# Altium schematic sheet Page_Tete.SchDoc
size A4; SheetNumber: 1; SheetTotal: 4
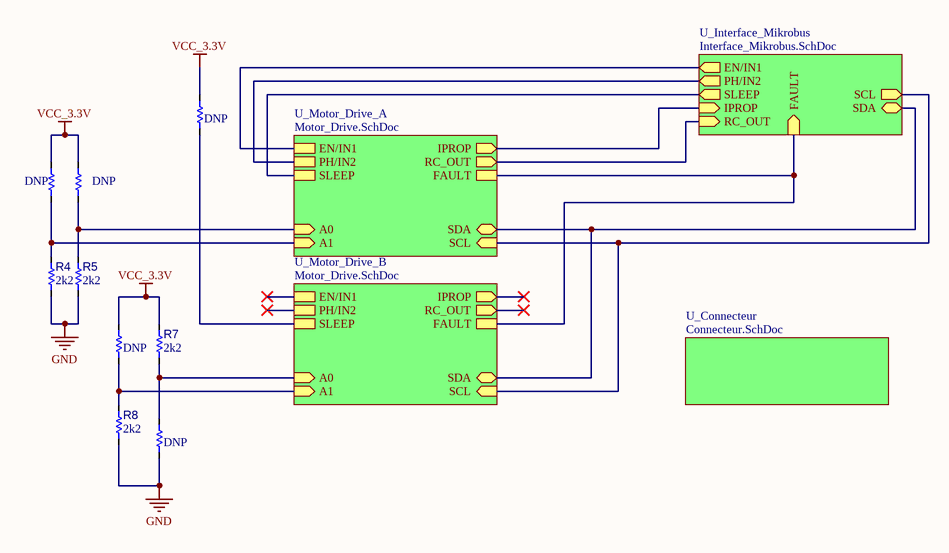
[diagram p0: Page_Tete.SchDoc]

## Parts
R1  value DNP  [R_1005[0402]]  (hidden comment: Res 2k2 1% 0402)  (no BOM)
R2  value DNP  [R_1005[0402]]  (hidden comment: Res 2k2 1% 0402)  (no BOM)
R3  value DNP  [R_1005[0402]]  (hidden comment: Res 2k2 1% 0402)  (no BOM)
R4  value 2k2  [R_1005[0402]]  (hidden comment: Res 2k2 1% 0402)
R5  value 2k2  [R_1005[0402]]  (hidden comment: Res 2k2 1% 0402)
R6  value DNP  [R_1005[0402]]  (hidden comment: Res 2k2 1% 0402)  (no BOM)
R7  value 2k2  [R_1005[0402]]  (hidden comment: Res 2k2 1% 0402)
R8  value 2k2  [R_1005[0402]]  (hidden comment: Res 2k2 1% 0402)
R9  value DNP  [R_1005[0402]]  (hidden comment: Res 2k2 1% 0402)  (no BOM)

## Sub-sheets
U_Connecteur = Connecteur.SchDoc: no entries
U_Interface_Mikrobus = Interface_Mikrobus.SchDoc: EN/IN1 (out), PH/IN2 (out), SLEEP (out), IPROP (in), SCL (out), SDA (bidir), RC_OUT (in), FAULT (in)
U_Motor_Drive_A = Motor_Drive.SchDoc: EN/IN1, PH/IN2, SLEEP, IPROP (out), FAULT, SCL (in), SDA (bidir), A0 (in), A1 (in), RC_OUT (out)
U_Motor_Drive_B = Motor_Drive.SchDoc: EN/IN1, PH/IN2, SLEEP, IPROP (out), FAULT, SCL (in), SDA (bidir), A0 (in), A1 (in), RC_OUT (out)

## Nets
GND: R4.1 R5.1 R8.1 R9.1
VCC_3.3V: R1.2 R2.2 R3.2 R6.2 R7.2
NetR1_1: R1.1 ; sheet U_Motor_Drive_B/SLEEP
NetR2_1: R2.1 R4.2 ; sheet U_Motor_Drive_A/A1
NetR3_1: R3.1 R5.2 ; sheet U_Motor_Drive_A/A0
NetR6_1: R6.1 R8.2 ; sheet U_Motor_Drive_B/A1
NetR7_1: R7.1 R9.2 ; sheet U_Motor_Drive_B/A0
(unnamed): sheet U_Motor_Drive_A/EN/IN1, sheet U_Interface_Mikrobus/EN/IN1
(unnamed): sheet U_Motor_Drive_A/PH/IN2, sheet U_Interface_Mikrobus/PH/IN2
(unnamed): sheet U_Motor_Drive_A/SLEEP, sheet U_Interface_Mikrobus/SLEEP
(unnamed): sheet U_Motor_Drive_A/IPROP, sheet U_Interface_Mikrobus/IPROP
(unnamed): sheet U_Motor_Drive_A/FAULT, sheet U_Motor_Drive_B/FAULT, sheet U_Interface_Mikrobus/FAULT
(unnamed): sheet U_Motor_Drive_A/SCL, sheet U_Motor_Drive_B/SCL, sheet U_Interface_Mikrobus/SCL
(unnamed): sheet U_Motor_Drive_A/SDA, sheet U_Motor_Drive_B/SDA, sheet U_Interface_Mikrobus/SDA
(unnamed): sheet U_Motor_Drive_A/RC_OUT, sheet U_Interface_Mikrobus/RC_OUT

## Library data of the parts
R1-R9 = RES008: Resistor type 1; Manufacturer 1: Yageo; Manufacturer Part Number 1: RC0402FR-072K2L; LibRef: RES008; Code CEGEP: RES2.2KSM; Puissance: 1/16W; Max Working Voltage: 50V; Tolerance: 1%; Mounting Technology: SMT; Supplier 1: LCSC; Supplier Part Number 1: C114762; Supplier 2: Digi-Key; Supplier Part Number 2: 311-2.20KLRCT-ND